# EAGLE design Tapper (EAGLE 9.4.2)

## Sheet 1 of 3
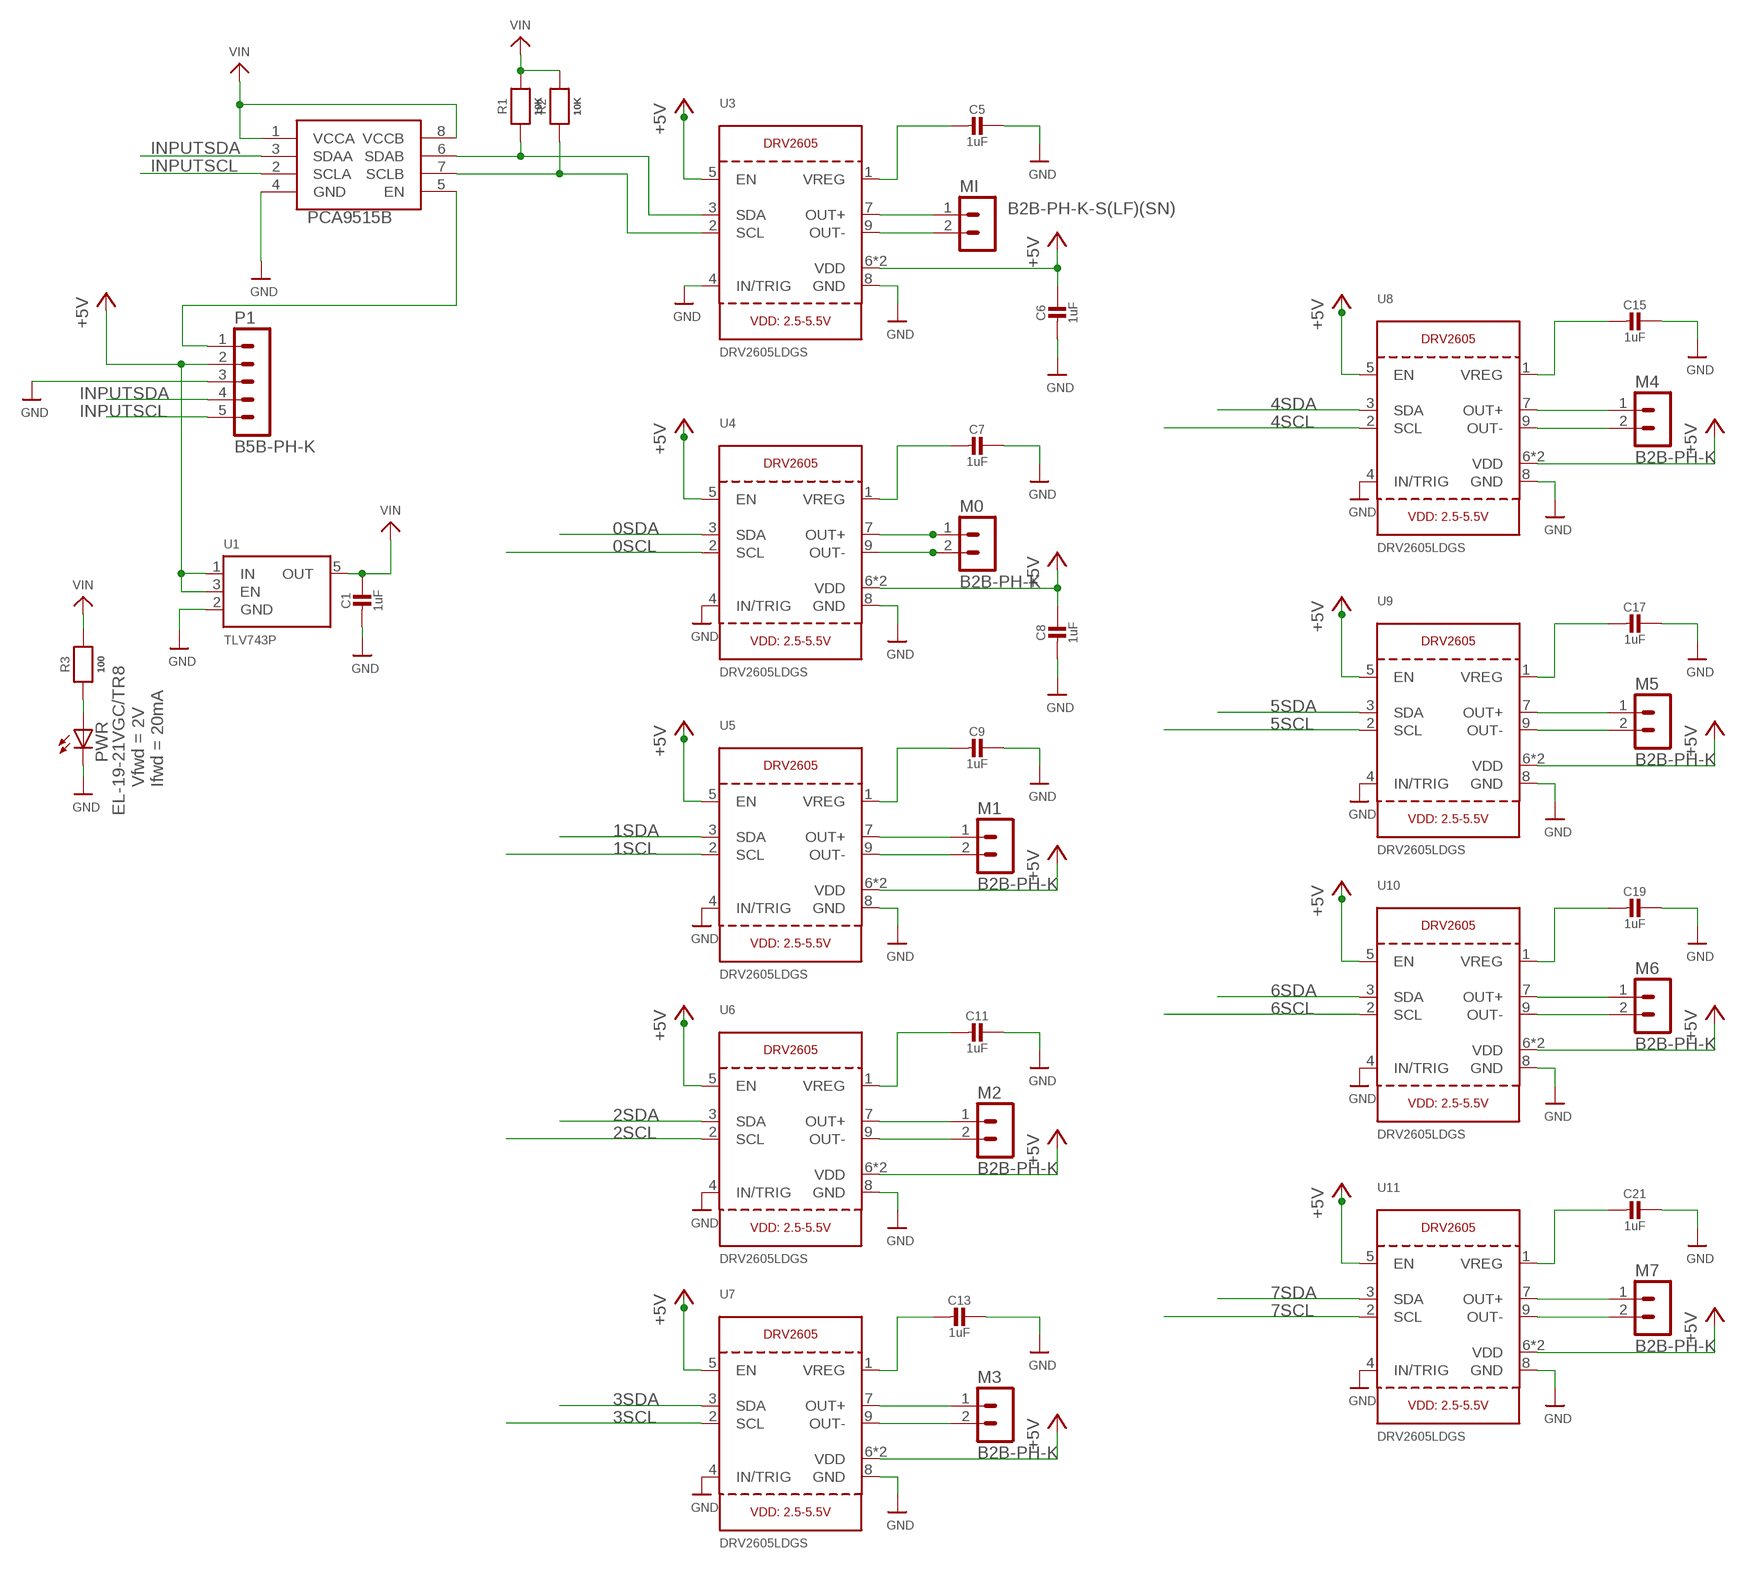
[diagram p0: schematic, sheet 1]

### Parts
C1  1uF  CAP_CERAMIC0805-NOOUTLINE  [0805-NO]
C5  1uF  CAP_CERAMIC0805-NOOUTLINE  [0805-NO]
C6  1uF  CAP_CERAMIC0805-NOOUTLINE  [0805-NO]
C7  1uF  CAP_CERAMIC0805-NOOUTLINE  [0805-NO]
C8  1uF  CAP_CERAMIC0805-NOOUTLINE  [0805-NO]
C9  1uF  CAP_CERAMIC0805-NOOUTLINE  [0805-NO]
C11  1uF  CAP_CERAMIC0805-NOOUTLINE  [0805-NO]
C13  1uF  CAP_CERAMIC0805-NOOUTLINE  [0805-NO]
C15  1uF  CAP_CERAMIC0805-NOOUTLINE  [0805-NO]
C17  1uF  CAP_CERAMIC0805-NOOUTLINE  [0805-NO]
C19  1uF  CAP_CERAMIC0805-NOOUTLINE  [0805-NO]
C21  1uF  CAP_CERAMIC0805-NOOUTLINE  [0805-NO]
M0  B2B-PH-K  [B2B-PH-K]
M1  B2B-PH-K  [B2B-PH-K]
M2  B2B-PH-K  [B2B-PH-K]
M3  B2B-PH-K  [B2B-PH-K]
M4  B2B-PH-K  [B2B-PH-K]
M5  B2B-PH-K  [B2B-PH-K]
M6  B2B-PH-K  [B2B-PH-K]
M7  B2B-PH-K  [B2B-PH-K]
MI  B2B-PH-K-S(LF)(SN)  B2B-PH-K  [B2B-PH-K]
P1  B5B-PH-K  [B5B-PH-K]
PWR  EL-19-21VGC/TR8  LEDCHIP-LED0603  [CHIP-LED0603]
R1  10K  RESISTOR0805_NOOUTLINE  [0805-NO]
R2  10K  RESISTOR0805_NOOUTLINE  [0805-NO]
R3  100  RESISTOR0805_NOOUTLINE  [0805-NO]
U1  TLV743P  LD39015XX  [SOT23-5]
U3  DRV2605LDGS  DRV2605_SOP  [PSOP10]
U4  DRV2605LDGS  DRV2605_SOP  [PSOP10]
U5  DRV2605LDGS  DRV2605_SOP  [PSOP10]
U6  DRV2605LDGS  DRV2605_SOP  [PSOP10]
U7  DRV2605LDGS  DRV2605_SOP  [PSOP10]
U8  DRV2605LDGS  DRV2605_SOP  [PSOP10]
U9  DRV2605LDGS  DRV2605_SOP  [PSOP10]
U10  DRV2605LDGS  DRV2605_SOP  [PSOP10]
U11  DRV2605LDGS  DRV2605_SOP  [PSOP10]
U23  PCA9515B  PCA9517  [SO-08]

### Nets
0SCL: U4.2(SCL) ; also sheet 2
0SDA: U4.3(SDA) ; also sheet 2
1SCL: U5.2(SCL) ; also sheet 2
1SDA: U5.3(SDA) ; also sheet 2
2SCL: U6.2(SCL) ; also sheet 2
2SDA: U6.3(SDA) ; also sheet 2
3SCL: U7.2(SCL) ; also sheet 2
3SDA: U7.3(SDA) ; also sheet 2
4SCL: U8.2(SCL) ; also sheet 2
4SDA: U8.3(SDA) ; also sheet 2
5SCL: U9.2(SCL) ; also sheet 2
5SDA: U9.3(SDA) ; also sheet 2
6SCL: U10.2(SCL) ; also sheet 2
6SDA: U10.3(SDA) ; also sheet 2
7SCL: U11.2(SCL) ; also sheet 2
7SDA: U11.3(SDA) ; also sheet 2
+5V [Power]: C6.1 C8.1 P1.2 U1.1(IN) U1.3(EN) U3.5(EN) U3.6(VDD) U3.10(VDD) U4.5(EN) U4.6(VDD) U4.10(VDD) U5.5(EN) U5.6(VDD) U5.10(VDD) U6.5(EN) U6.6(VDD) U6.10(VDD) U7.5(EN) U7.6(VDD) U7.10(VDD) U8.5(EN) U8.6(VDD) U8.10(VDD) U9.5(EN) U9.6(VDD) U9.10(VDD) U10.5(EN) U10.6(VDD) U10.10(VDD) U11.5(EN) U11.6(VDD) U11.10(VDD)
GND [Ground]: C1.2 C5.1 C6.2 C7.1 C8.2 C9.1 C11.1 C13.1 C15.1 C17.1 C19.1 C21.1 P1.3 PWR.C U1.2(GND) U3.4(IN/TRIG) U3.8(GND) U4.4(IN/TRIG) U4.8(GND) U5.4(IN/TRIG) U5.8(GND) U6.4(IN/TRIG) U6.8(GND) U7.4(IN/TRIG) U7.8(GND) U8.4(IN/TRIG) U8.8(GND) U9.4(IN/TRIG) U9.8(GND) U10.4(IN/TRIG) U10.8(GND) U11.4(IN/TRIG) U11.8(GND) U23.4(GND) ; also sheet 2
INPUTSCL: P1.5 U23.2(SCLA) ; also sheet 2
INPUTSDA: P1.4 U23.3(SDAA) ; also sheet 2
N$1: M0.2 U4.9(OUT-)
N$2: C5.2 U3.1(VREG)
N$3: C7.2 U4.1(VREG)
N$4: C9.2 U5.1(VREG)
N$5: P1.1 U23.5(EN)
N$6: C11.2 U6.1(VREG)
N$7: C13.2 U7.1(VREG)
N$8: C15.2 U8.1(VREG)
N$9: C17.2 U9.1(VREG)
N$10: C19.2 U10.1(VREG)
N$11: C21.2 U11.1(VREG)
N$12: R1.1 U3.3(SDA) U23.6(SDAB)
N$13: R2.1 U3.2(SCL) U23.7(SCLB)
N$14: PWR.A R3.1
OUT+2: MI.1 U3.7(OUT+)
OUT+3: M0.1 U4.7(OUT+)
OUT+4: M1.1 U5.7(OUT+)
OUT+5: M2.1 U6.7(OUT+)
OUT+6: M3.1 U7.7(OUT+)
OUT+7: M4.1 U8.7(OUT+)
OUT+8: M5.1 U9.7(OUT+)
OUT+9: M6.1 U10.7(OUT+)
OUT+10: M7.1 U11.7(OUT+)
OUT-2: MI.2 U3.9(OUT-)
OUT-4: M1.2 U5.9(OUT-)
OUT-5: M2.2 U6.9(OUT-)
OUT-6: M3.2 U7.9(OUT-)
OUT-7: M4.2 U8.9(OUT-)
OUT-8: M5.2 U9.9(OUT-)
OUT-9: M6.2 U10.9(OUT-)
OUT-10: M7.2 U11.9(OUT-)
VIN: C1.1 R1.2 R2.2 R3.2 U1.5(OUT) U23.1(VCCA) U23.8(VCCB) ; also sheet 2

### Notes on the sheet
- PCA9515B
- Vfwd = 2V
  Ifwd = 20mA

## Sheet 2 of 3
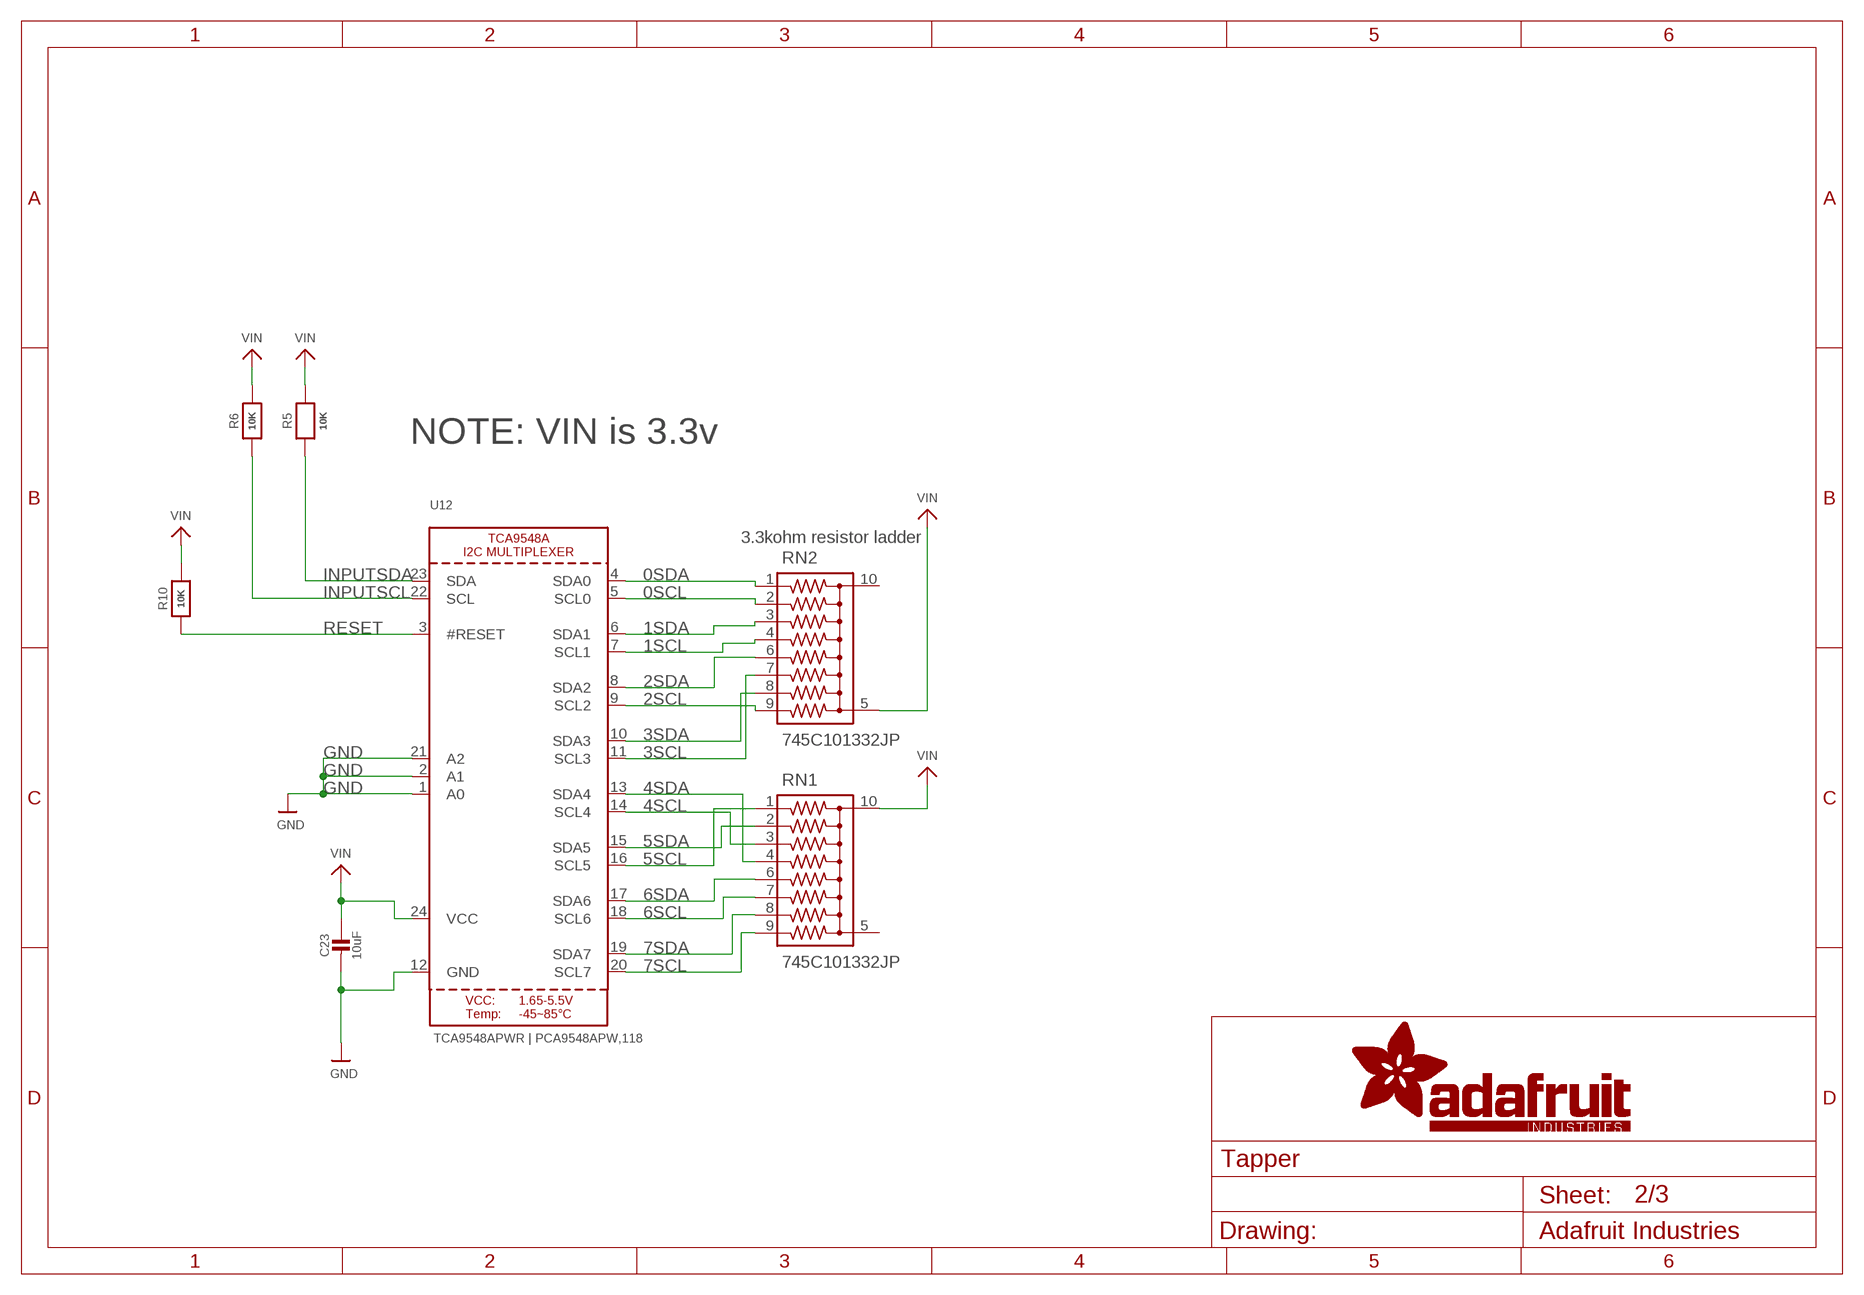
[diagram p1: schematic, sheet 2]

### Parts
C23  10uF  CAP_CERAMIC0805-NOOUTLINE  [0805-NO]
R5  10K  RESISTOR0805_NOOUTLINE  [0805-NO]
R6  10K  RESISTOR0805_NOOUTLINE  [0805-NO]
R10  10K  RESISTOR_0805MP  [_0805MP]
RN1  745C101332JP  745-10NS  [745-10NS]
RN2  745C101332JP  745-10NS  [745-10NS]
U12  TCA9548APWR | PCA9548APW,118  TCA9548A  [TSSOP24]

### Nets
0SCL: RN2.2 U12.5(SCL0) ; also sheet 1
0SDA: RN2.1 U12.4(SDA0) ; also sheet 1
1SCL: RN2.4 U12.7(SCL1) ; also sheet 1
1SDA: RN2.3 U12.6(SDA1) ; also sheet 1
2SCL: RN2.9 U12.9(SCL2) ; also sheet 1
2SDA: RN2.6 U12.8(SDA2) ; also sheet 1
3SCL: RN2.7 U12.11(SCL3) ; also sheet 1
3SDA: RN2.8 U12.10(SDA3) ; also sheet 1
4SCL: RN1.3 U12.14(SCL4) ; also sheet 1
4SDA: RN1.4 U12.13(SDA4) ; also sheet 1
5SCL: RN1.1 U12.16(SCL5) ; also sheet 1
5SDA: RN1.2 U12.15(SDA5) ; also sheet 1
6SCL: RN1.7 U12.18(SCL6) ; also sheet 1
6SDA: RN1.6 U12.17(SDA6) ; also sheet 1
7SCL: RN1.9 U12.20(SCL7) ; also sheet 1
7SDA: RN1.8 U12.19(SDA7) ; also sheet 1
GND [Ground]: C23.2 U12.1(A0) U12.2(A1) U12.12(GND) U12.21(A2) ; also sheet 1
INPUTSCL: R6.1 U12.22(SCL) ; also sheet 1
INPUTSDA: R5.1 U12.23(SDA) ; also sheet 1
RESET: R10.1 U12.3(#RESET)
VIN: C23.1 R5.2 R6.2 R10.2 RN1.10 RN2.5 U12.24(VCC) ; also sheet 1
Unconnected: RN1.5 RN2.10

### Notes on the sheet
- NOTE: VIN is 3.3v
- 3.3kohm resistor ladder

## Sheet 3 of 3

## Library data of the parts
C1 C5-C9 C11 C13 C15 C17 C19 C21 C23 = microbuilder:CAP_CERAMIC: Ceramic Capacitors For new designs, use the packages preceded by an '_' character since they are more reliable: The following footprints should be used on most boards: _0402 - Standard footprint for regular board layouts _0603 - Standard footprint for regular board layouts _0805 - Standard footprint for regular board layouts _1206 - Standard footprint for regular board layouts For extremely tight-pitch boards where space is at a premium, the following 'micro-pitch' footprints can be used (smaller pads, no silkscreen outline, etc.): _0402MP - Micro-pitch footprint for very dense/compact boards _0603MP - Micro-pitch footprint for very dense/compact boards _0805MP - Micro-pitch footprint for very dense/compact boards _1206MP - Micro-pitch footprint for very dense/compact boards
M0 M1-M7 MI = con-jst-ph:B2B-PH-K: HEADER
P1 = con-jst-ph:B5B-PH-K: HEADER
PWR = adafruit:LED: LED OSRAM: - CHIPLED LG R971, LG N971, LY N971, LG Q971, LY Q971, LO R971, LY R971 LH N974, LH R974 LS Q976, LO Q976, LY Q976 LO Q996 - Hyper CHIPLED LW Q18S LB Q993, LB Q99A, LB R99A - SideLED LS A670, LO A670, LY A670, LG A670, LP A670 LB A673, LV A673, LT A673, LW A673 LH A674 LY A675 LS A676, LA A676, LO A676, LY A676, LW A676 LS A679, LY A679, LG A679 - Hyper Micro SIDELED® LS Y876, LA Y876, LO Y876, LY Y876 LT Y87S - SmartLED LW L88C, LW L88S LB L89C, LB L89S, LG L890 LS L89K, LO L89K, LY L89K LS L896, LA L896, LO L896, LY L896 - TOPLED LS T670, LO T670, LY T670, LG T670, LP T670 LSG T670, LSP T670, LSY T670, LOP T670, LYG T670 LG T671, LOG T671, LSG T671 LB T673, LV T673, LT T673, LW T673 LH T674 LS T676, LA T676, LO T676, LY T676, LB T676, LH T676, LSB T676, LW T676 LB T67C, LV T67C, LT T67C, LS T67K, LO T67K, LY T67K, LW E67C LS E67B, LA E67B, LO E67B, LY E67B, LB E67C, LV E67C, LT E67C LW T67C LS T679, LY T679, LG T679 LS T770, LO T770, LY T770, LG T770, LP T770 LB T773, LV T773, LT T773, LW T773 LH T774 LS E675, LA E675, LY E675, LS T675 LS T776, LA T776, LO T776, LY T776, LB T776 LHGB T686 LT T68C, LB T68C - Hyper Mini TOPLED® LB M676 - Mini TOPLED Santana® LG M470 LS M47K, LO M47K, LY M47K Source: http://www.osram.convergy.de/
R1-R3 R5 R6 R10 = microbuilder:RESISTOR: Resistors For new designs, use the packages preceded by an '_' character since they are more reliable: The following footprints should be used on most boards: _0402 - Standard footprint for regular board layouts _0603 - Standard footprint for regular board layouts _0805 - Standard footprint for regular board layouts _1206 - Standard footprint for regular board layouts For extremely tight-pitch boards where space is at a premium, the following 'micro-pitch' footprints can be used (smaller pads, no silkscreen outline, etc.): _0402MP - Micro-pitch footprint for very dense/compact boards _0603MP - Micro-pitch footprint for very dense/compact boards _0805MP - Micro-pitch footprint for very dense/compact boards _1206MP - Micro-pitch footprint for very dense/compact boards
RN1 RN2 = resistor-array:745-10: CTS 745 Series 8 Resistors, 10 Terminations
U1 = microbuilder:LD39015XX: LDO Fixed Voltage Regulator 150mA The LD39015xx voltage regulator is ideal for regulating battery or solar power due to it's very low foreward voltage drop (~100mV at 150mA). Forward Voltage Dropout: 100mV at 150mA, 80mV at 100mA Input Voltage Range: 1.5V-5.5V Output Voltage Range: 0.8V-3.3V (depending on model) Digikey: 1.8V - 497-6977-1-ND
U3-U11 = microbuilder:DRV2605: DRV2605 - Haptic Driver for ERM/LRA Motors
U12 = microbuilder:TCA9548A: TCA9548A I2C Multiplexer
U23 = PCA9517:PCA9517

## Net classes
1 Ground: width 0.203 mm, drill 0.305 mm
2 Power: width 0.305 mm, drill 0.305 mm

## Board
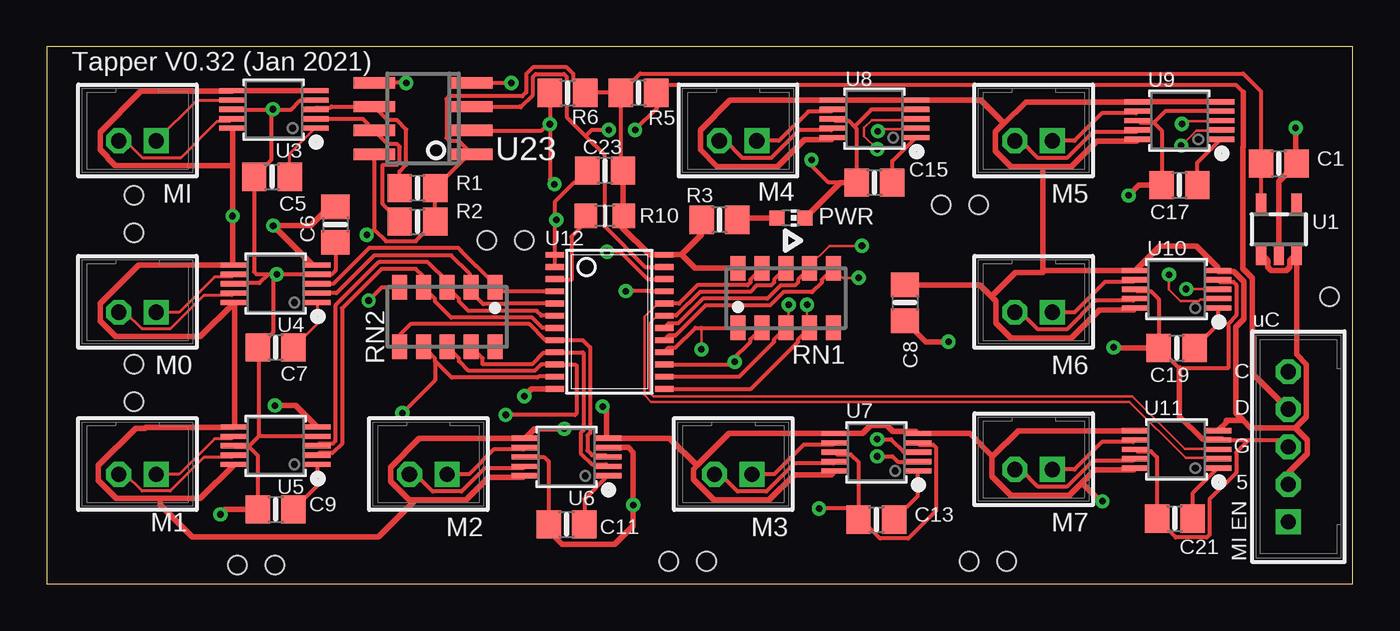
[diagram p2: board, top side]
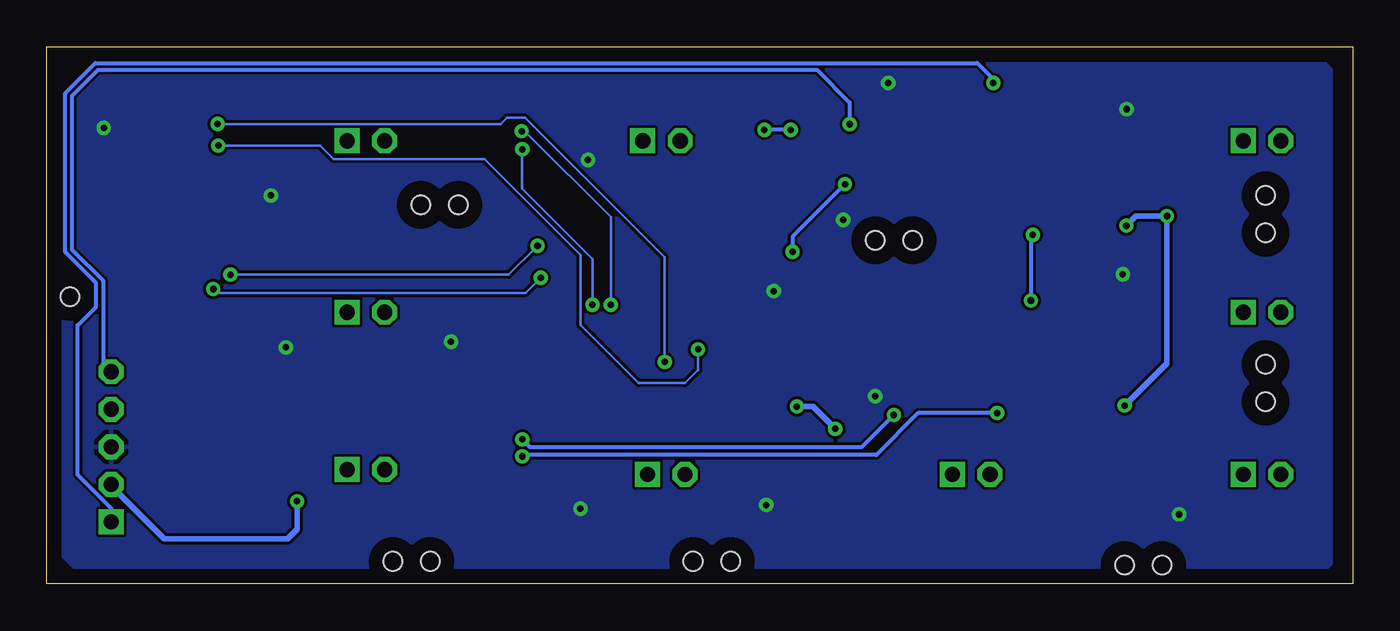
[diagram p3: board, bottom side, seen from below]

Size 69.58 x 28.63 mm. Coordinates in mm from the lower left corner, seen from the top.
Outline: 0,0 69.58,0 69.58,28.63 0,28.63 0,0
Copper layers (1+16): Top 0.035mm / dielectric 1.5mm / Bottom 0.035mm
Design rules "default *": minimum track width 5mil, minimum drill 0.35mm, track to track 6mil, track to pad 6mil, pad to pad 6mil, via to via 6mil, smd to smd 6mil, copper to edge 30mil, drill to drill 6mil, minimum pad ring 10mil, minimum via ring 8mil, stop-mask expansion 4mil, vias tented up to drill 0mil, thermal gap 10mil
Holes 1 mm at 4.64,20.71 4.64,18.71 4.64,11.71 4.64,9.71 23.44,18.31 25.44,18.31 47.64,20.21 49.64,20.21 49.14,1.21 51.14,1.21 33.14,1.21 35.14,1.21 10.14,1.01 12.14,1.01 68.34,15.31

### Footprints (pad centres in the part's own frame; a part is rotated, then mirrored left to right if it is on the bottom)
0805-NO = smd 1.3 x 1.5: 1 -0.95,0; 2 0.95,0
B2B-PH-K = drill 0.813 square: 1 -1,0 | drill 0.813 octagon: 2 1,0
B5B-PH-K = drill 0.813 square: 1 -4,0 | drill 0.813 octagon: 2 -2,0; 3 0,0; 4 2,0; 5 4,0
CHIP-LED0603 = smd 0.8 x 0.8: A 0,-0.75; C 0,0.75
_0805MP = smd 1.2 x 1.3: 1 -1.016,0; 2 1.016,0
745-10NS = smd 0.8 x 1.3: 1 -2.54,-1.587; 2 -1.27,-1.587; 3 0,-1.587; 4 1.27,-1.587; 5 2.54,-1.587; 6 2.54,1.587; 7 1.27,1.587; 8 0,1.587; 9 -1.27,1.587; 10 -2.54,1.587
SOT23-5 = smd 0.55 x 1.2: 1 -0.95,-1.3; 2 0,-1.3; 3 0.95,-1.3; 4 0.95,1.3; 5 -0.95,1.3
PSOP10 = smd 0.28 x 1.45: 1 -1,-2.2; 2 -0.5,-2.2; 3 0,-2.2; 4 0.5,-2.2; 5 1,-2.2; 6 1,2.2; 7 0.5,2.2; 8 0,2.2; 9 -0.5,2.2; 10 -1,2.2
TSSOP24 = smd 0.305 x 0.991: 1 -3.575,-2.918; 2 -2.925,-2.918; 3 -2.275,-2.918; 4 -1.625,-2.918; 5 -0.975,-2.918; 6 -0.325,-2.918; 7 0.325,-2.918; 8 0.975,-2.918; 9 1.625,-2.918; 10 2.275,-2.918; 11 2.925,-2.918; 12 3.575,-2.918; 13 3.575,2.918; 14 2.925,2.918; 15 2.275,2.918; 16 1.625,2.918; 17 0.975,2.918; 18 0.325,2.918; 19 -0.325,2.918; 20 -0.975,2.918; 21 -1.625,2.918; 22 -2.275,2.918; 23 -2.925,2.918; 24 -3.575,2.918
SO-08 = smd 0.6 x 2.2: 1 -1.905,-2.6; 2 -0.635,-2.6; 3 0.635,-2.6; 4 1.905,-2.6; 5 1.905,2.6; 6 0.635,2.6; 7 -0.635,2.6; 8 -1.905,2.6

### Placement (x,y rotation side)
C1  65.64,22.41 0 top
C5  11.99,21.7 0 top
C6  15.37,19.16 270 top
C7  12.19,12.61 0 top
C8  45.72,14.99 270 top
C9  12.19,3.97 0 top
C11  27.69,3.17 0 top
C13  44.2,3.43 0 top
C15  44.1,21.4 0 top
C17  60.35,21.25 0 top
C19  60.2,12.57 0 top
C21  60.1,3.48 0 top
C23  29.75,22.03 180 top
M0  4.83,14.48 180 top
M1  4.83,5.84 180 top
M2  20.32,5.84 180 top
M3  36.58,5.84 180 top
M4  36.83,23.62 180 top
M5  52.58,23.62 180 top
M6  52.58,14.48 180 top
M7  52.58,6.1 180 top
MI  4.83,23.62 180 top
P1  66.14,7.31 90 top
PWR  39.64,19.51 270 top
R1  19.74,21.11 0 top
R2  19.74,19.31 0 top
R3  35.84,19.41 180 top
R5  31.53,26.18 180 top
R6  27.75,26.18 0 top
R10  29.73,19.63 0 top
RN1  39.37,15.24 0 top
RN2  21.34,14.22 180 top
U1  65.64,18.91 0 top
U3  12.09,25.29 90 top
U4  12.19,16 90 top
U5  12.19,7.36 90 top
U6  27.69,6.76 90 top
U7  44.2,7.02 90 top
U8  44.1,24.79 90 top
U9  60.35,24.7 90 top
U10  60.2,15.71 90 top
U11  60.2,7.17 90 top
U12  29.97,13.97 270 top
U23  20.04,24.81 90 top

### Tracks (layer width: path | path; a pad name or v marks a point on that pad's centre or on a via)
0SCL
  Top 0.203: U12.5 24.42,14.95 24.38,14.91 23.24,14.91 22.61,15.54 RN2.2 22.54,15.87 22.54,16.51 21.54,17.51 17.44,17.51 15.44,15.5 U4.2
0SDA
  Top 0.203: U12.4 24.09,15.59 RN2.1 23.88,15.95 22.88,16.94 22.08,17.74 22.08,17.75 21.91,17.91 17.19,17.91 15.28,16 U4.3
1SCL
  Top 0.203: U12.7 26.41,13.64 25.85,14.2 21.54,14.2 20.68,15.06 20.68,15.2 RN2.4 20.07,16.38 19.66,16.79 17.84,16.79 15.73,14.69 15.73,7.47 15.23,6.97 14.5,6.97 U5.2
1SDA
  Top 0.203: U12.6 26.35,14.29 26.1,14.55 22.46,14.55 21.95,15.06 21.95,15.2 RN2.3 21.34,16.1 21.34,16.11 20.3,17.15 17.69,17.15 15.37,14.83 15.37,7.62 15.22,7.47 14.5,7.47 U5.3
2SCL
  Top 0.203: RN2.9 23.22,12.02 23.22,11.71 25.84,11.71 26.44,12.31 27.02,12.31 U12.9 28.55,12.34 28.59,12.31 28.59,8.19 28.45,8.05 28.45,6.96 29.04,6.37 29.78,6.37 U6.2
2SDA
  Top 0.203: RN2.6 18.8,13.26 19.38,13.84 25.71,13.84 26.55,12.99 U12.8 28.55,12.99 28.94,12.61 28.94,8.05 28.8,7.9 28.8,7.11 29.04,6.87 29.78,6.87 U6.3
3SCL  (via drill 0.35)
  Top 0.203: U12.11 26.19,11.04 26.14,10.99 21.57,10.99 20.68,11.88 | 20.68,11.88 20.68,12.02 RN2.7 | v18.94,9.11 20.68,10.84 20.68,11.88 | v44.24,6.8 45.05,6.8 45.34,6.51 U7.2
  Bottom 0.203: v18.94,9.11 23.15,9.11 25.38,6.87 44.18,6.87 44.24,6.81 v44.24,6.8
3SDA  (via drill 0.35)
  Top 0.203: RN2.8 21.95,12.02 21.95,11.88 22.48,11.35 25.99,11.35 26.34,11.7 U12.10 28.16,11.7 28.23,11.62 28.23,9.11 28.13,9.01 v24.44,9.01 | U7.3 46.36,7.06 45.63,7.06 44.98,7.71 v44.24,7.71
  Bottom 0.203: v44.24,7.71 43.84,7.31 26.14,7.31 v24.44,9.01
4SCL  (via drill 0.35)
  Top 0.127: v44.28,24.13 44.39,24.24 46.23,24.24 U8.2 | v39.53,14.88 39.53,13.76 39.46,13.69 RN1.3
  Top 0.203: RN1.3 38.75,13.04 38.75,12.9 36.9,11.04 U12.14
  Bottom 0.127: v44.28,24.13 44.16,24.01 43.98,24.01 39.53,19.56 v39.53,14.88
4SDA  (via drill 0.35)
  Top 0.127: v44.25,23.17 43.55,23.87 43.55,24.31 43.97,24.73 46.23,24.73 U8.3 | v40.51,14.88 40.51,13.62 RN1.4
  Top 0.203: RN1.4 40.02,13.04 40.02,12.9 37.52,10.39 U12.13
  Bottom 0.127: v44.25,23.17 44.25,21.07 40.51,17.32 v40.51,14.88
5SCL  (via drill 0.35)
  Top 0.127: v60.44,23.37 61.24,24.17 62.51,24.17 U9.2 | 34.88,13.65 v34.88,12.5
  Top 0.203: U12.16 33.13,12.59 33.49,12.59 34.55,13.65 34.88,13.65 RN1.1
  Bottom 0.127: v60.44,23.37 55,23.37 54.29,22.65 46.25,22.65 41.13,17.53 41.13,13.8 38.04,10.71 35.57,10.71 34.88,11.4 v34.88,12.5
5SDA  (via drill 0.35)
  Top 0.127: v60.48,24.52 60.62,24.66 62.51,24.66 U9.3 | v36.65,11.83 36.54,11.95
  Top 0.203: RN1.2 37.48,13.04 37.48,12.9 36.54,11.95 36.28,11.7 U12.15
  Bottom 0.127: v60.48,24.52 45.4,24.52 45.06,24.86 44.1,24.86 36.65,17.41 v36.65,11.83
6SCL  (via drill 0.35)
  Top 0.127: v59.8,16.48 59.8,15.68 60.39,15.09 61.39,15.09 61.46,15.16 62.37,15.16 U10.2 | v43.43,18.02 41.69,18.02 40.58,16.9 RN1.7
  Top 0.203: RN1.7 40.02,16.21 40.02,16.07 39.86,15.91 39.09,15.91 38.39,15.21 34.95,15.21 33.63,13.89 33.13,13.89 U12.18
  Bottom 0.127: v59.8,16.48 44.97,16.48 v43.43,18.02
6SDA  (via drill 0.35)
  Top 0.127: v60.71,15.72 62.37,15.72 U10.3 | v43.26,16.32 42.42,16.32 RN1.6
  Top 0.203: RN1.6 41.29,16.21 41.29,16.07 40.77,15.55 39.24,15.55 38.54,14.85 35.1,14.85 33.49,13.24 33.13,13.24 U12.17
  Bottom 0.127: v43.26,16.32 44.06,15.52 60.51,15.52 v60.71,15.72
7SCL
  Top 0.127: U11.2 62.37,6.71 60.69,6.71 57.69,9.71 32.19,9.71 31.84,10.06 31.84,14.25 32.47,14.88 32.82,14.88 U12.20
  Top 0.203: RN1.9 37.48,16.21 37.48,16.07 37.34,15.92 34.66,15.92 33.68,14.95 U12.20
7SDA
  Top 0.127: U11.3 62.37,7.2 60.62,7.2 57.83,9.99 32.33,9.99 32.12,10.2 32.12,13.9 32.47,14.25 32.82,14.25 U12.19
  Top 0.203: RN1.8 38.75,16.21 38.75,16.07 38.59,15.91 37.82,15.91 37.48,15.57 34.81,15.57 33.54,14.29 U12.19
+5V  (via drill 0.35)
  Top 0.305: U3.10 9.89,22.31 | 9.89,22.31 v9.89,19.61 9.89,17.1 U4.6 4.89,17 2.84,14.95 2.84,14.01 3.66,13.18 8.18,13.18 U4.10 U5.6 9.96,8.33 5.27,8.33 5.23,8.29 4.72,8.29 2.74,6.31 2.74,5.51 3.7,4.55 6.04,4.55 | 9.89,22.31 3.64,22.31 3.24,22.71 3.24,22.75 2.84,23.15 2.84,24.09 5,26.26 9.86,26.26 U3.6 U3.5 | 6.04,4.55 8.18,4.55 U5.10 | U6.10 25.39,5.66 23.52,5.66 22.33,4.47 19.64,4.47 | 19.64,4.47 19.3,4.47 18.31,5.46 18.31,6.22 19.84,7.76 U6.6 25.56,7.82 26,8.26 v27.56,8.26 | 34.65,6.31 36.35,8.01 U7.6 43.46,8.02 43.88,8.44 44.75,8.44 45.07,8.12 46.3,8.12 U7.5 49.18,8.02 50.39,6.81 | 34.65,6.31 34.44,6.11 34.44,5.58 35.55,4.47 38.49,4.47 39.84,5.82 41.8,5.82 U7.10 | U11.6 51.75,8.17 50.39,6.81 | 50.39,6.81 50.34,6.81 50.34,5.74 51.35,4.73 54.49,4.73 55.16,5.39 | U11.10 57.9,6.07 55.84,6.07 55.16,5.39 | 53.08,16.7 U10.6 59.3,18.01 61.24,18.01 62.4,16.85 U10.5 62.45,16.65 63.25,16.65 63.78,16.12 63.78,14.13 63.35,13.7 63.35,9.1 63.74,8.71 | U10.10 57.9,14.61 56.09,14.61 54.59,13.11 51.35,13.11 50.56,13.9 50.56,15.09 50.33,15.32 | 50.33,15.32 51.61,16.6 53.08,16.6 53.08,16.7 | 50.99,24.56 50.54,24.11 50.54,23.06 51.35,22.25 53.08,22.25 | U9.10 58.05,23.6 55.94,23.6 54.59,22.25 53.08,22.25 | U8.10 41.8,23.69 40.38,23.69 38.94,22.25 35.71,22.25 34.82,23.14 34.82,24.2 36.4,25.78 U8.6 U8.5 49.76,25.79 50.99,24.56 | 50.99,24.56 51.01,24.54 52.16,25.69 U9.6 U9.5 | C6.1 15.07,20.11 14.06,19.09 v12.06,19.09 14.15,17 U4.5 | 34.65,6.31 33.19,7.76 U6.5 29.82,7.82 29.82,9.24 v29.61,9.45 | 19.64,4.47 17.68,2.51 7.74,2.51 6.04,4.21 6.04,4.55 | v12.14,9.51 13.25,9.51 U5.5
  Top 0.305: U11.5 62.84,8.62 62.84,8.71 63.74,8.71 | C8.1 49.71,15.94 50.33,15.32 | v56.24,4.41 56.14,4.41 55.16,5.39 | 53.08,16.7 53.08,22.25 | 66.52,8.32 67.16,7.68 67.16,6.93 66.14,5.91 P1.2 | 63.74,8.71 64.13,8.32 66.52,8.32 | U1.1 65.06,17.24 65.06,16.88 65.24,16.7 66.05,16.7 66.22,16.88 66.22,17.24 U1.3 66.59,12.22 67.11,11.71 67.11,8.91 66.54,8.34 66.52,8.32
  Bottom 0.305: v12.06,19.09 11.54,19.61 v9.89,19.61 9.89,11.76 v12.14,9.51 | v56.24,4.41 56.24,2.91 56.74,2.41 63.32,2.41 66.14,5.23 P1.2 | v29.61,9.45 28.75,9.45 v27.56,8.26
GND  (via drill 0.35)
  Top 0.203: U5.8 10.06,7.29 10.71,7.29 | 11.28,7.86 10.71,7.29 | U4.8 10.02,16.03 11.31,16.03 11.78,16.5 | 12.04,16.5 U4.4 15.16,16.5 15.37,16.71 C6.2 | 12.04,16.5 11.78,16.5 | 11.78,16.5 11.18,16.5 11.04,16.64 C5.1 11.94,22.6 11.94,25.29 | U3.4 14.26,25.76 13.47,25.76 13,25.29 11.94,25.29 | U3.8 11.94,25.29 | 12.04,16.5 12.04,13.41 C7.1 11.28,12.57 11.28,7.86 | 10.71,7.29 10.75,7.26 10.82,7.26 11.24,6.84 C9.1 | C11.1 26.74,6.54 26.72,6.53 26.49,6.76 U6.8 | U7.8 42.1,6.91 42.83,6.91 43.25,6.49 C13.1 | U7.4 46.5,7.41 47.23,7.41 47.38,7.26 47.38,3.9 45.9,2.42 44.39,2.42 43.39,3.43 C13.1 | U11.8 58.1,7.07 58.83,7.07 59.15,6.75 C21.1 60.15,2.48 61.8,2.48 61.95,2.63 61.95,4.5 63.38,5.93 63.38,7 64.04,7.67 | U11.4 62.64,7.67 64.04,7.67 | U10.8 58.1,15.6 58.83,15.6 59.25,15.18 C19.1 60.31,11.51 60.34,11.51 62.94,11.51 62.94,13.86 63.38,14.3 63.38,15.95 63.23,16.1 62.5,16.1 U10.4 | U9.8 58.26,24.59 58.98,24.59 | 58.98,24.59 59.4,24.17 C17.1 | U8.8 42,24.68 42.73,24.68 43.02,24.39 | 43.02,24.39 43.15,24.26 C15.1 41.65,21.4 40.74,22.31 v40.74,22.61 | U8.4 43.93,25.29 43.02,24.39 | C23.2 28.16,21.39 28.1,21.39 27.05,20.34 27.05,19.41 | 27.05,19.41 U12.1 U12.2 | 26.88,3.17 C11.1 | C13.1 42.66,4.01 v41.14,4.01 | U12.21 32.15,15.59 32.14,15.61 v30.84,15.61 | C11.1 26.56,2.99 | U9.4 59.59,25.2 58.98,24.59 | U5.4 14.38,7.89 11.38,7.89 11.28,7.86 | 45.68,14.11 C8.2 | 64.04,7.67 65.78,7.67 P1.3 | v27.14,19.41 27.05,19.41 | U23.4 v24.74,26.71
  Top 0.305: U1.2 65.64,21.46 C1.2 66.54,22.46 v66.54,24.31 | 62.64,7.67 62.6,7.71 61.56,7.71 60.34,8.93 60.34,11.51 | C17.1 58.19,21.25 v57.64,20.71 | 41.04,4.01 v41.14,4.01 | U12.12 25.83,10.39 v25.44,10.01 | C9.1 9.51,3.97 v9.24,3.71 | C19.1 56.88,12.57 v56.84,12.61 | C8.2 46.85,12.91 v48.04,12.91 | U6.4 30.99,7.26 31.24,7.01 v31.24,4.21 31.24,3.11 30.24,2.11 27.44,2.11 26.56,2.99 | PWR.C 42.29,21.4 C15.1
  other vias: 12.24,16.51 12.04,25.31
  pour Bottom: 1.84,27.71 68.34,27.71 68.74,27.31 68.74,1.51 68.14,0.91 1.34,0.91 1.14,1.11 1.14,27.41 1.24,27.51 1.44,27.71 1.64,27.71
INPUTSCL  (via drill 0.35)
  Top 0.203: v27.04,21.31 26.8,21.55 v26.8,24.51 26.8,24.61 | v29.84,17.71 30.54,17.71 32.01,16.25 U12.22 | R6.1 26.8,24.61 | U23.2 26.36,24.17 26.8,24.61
  Bottom 0.203: v27.04,21.31 29.84,18.51 v29.84,17.71 | P1.5 66.58,11.74 66.58,16.17 68.24,17.83 68.24,26.01 66.84,27.41 28.54,27.41 26.8,25.66 v26.8,24.51
INPUTSDA  (via drill 0.35)
  Top 0.203: U12.23 31.87,16.89 29.7,19.06 29.7,22.88 28.71,23.87 | R5.1 32.53,26.22 | 32.53,26.22 32.91,26.61 63.34,26.61 63.74,26.21 | U23.3 25.21,25.44 25.24,25.41 25.89,26.06 25.89,27.03 26.04,27.18 27.55,27.18 27.7,27.03 27.7,24.88 28.71,23.87 | 28.71,23.87 29.04,24.21 v29.94,24.21 | v31.34,24.21 32.53,25.39 32.53,26.22
  Top 0.305: 63.74,26.21 63.74,23.29 63.74,23.28 63.74,16.81 64.24,16.31 64.24,11.21 P1.4
  Bottom 0.203: v29.94,24.21 v31.34,24.21
N$1
  Top 0.152: U4.9 9.86,15.37 8.36,15.37 6.58,13.59 5.07,13.59 4.18,14.48 M0.2
N$2
  Top 0.152: C5.2 12.94,22.94 U3.1
N$3
  Top 0.152: U4.1 14.39,13.86 C7.2
N$4
  Top 0.203: U5.1 14.39,5.22 C9.2
N$5  (via drill 0.35)
  Top 0.203: v19.14,26.71 U23.5
  Bottom 0.203: P1.1 66.14,4.01 67.94,5.81 67.94,13.78 66.98,14.74 66.98,16.07 68.6,17.69 68.6,26.15 66.99,27.76 20,27.76 19.14,26.91 v19.14,26.71
N$6
  Top 0.203: U6.1 28.64,4.51 C11.2
N$7
  Top 0.203: U7.1 46.4,4.68 C13.2
N$8
  Top 0.203: C15.2 45.05,22.54 U8.1
N$9
  Top 0.203: C17.2 61.3,22.45 U9.1
N$10
  Top 0.203: U10.1 62.4,13.82 C19.2
N$11
  Top 0.203: U11.1 61.05,4.82 C21.2
N$12
  Top 0.203: U3.3 14.4,25.4 15.12,25.4 15.17,25.44 U23.6 18.16,24.72 18.65,24.72 19.15,24.22 19.15,22.35 18.79,21.99 R1.1
N$13
  Top 0.203: U3.2 16.82,24.79 U23.7 18.16,23.45 18.65,23.45 18.8,23.31 18.8,22.5 18.65,22.35 17.89,22.35 17.89,20.25 18.79,19.35 R2.1
N$14
  Top 0.305: PWR.A 36.89,19.51 R3.1
OUT+2
  Top 0.152: MI.1 7.99,25.79 U3.7
OUT+3
  Top 0.152: U4.7 9.86,16.37 8.93,16.37 7.04,14.48 M0.1
OUT+4
  Top 0.152: U5.7 9.86,7.73 8.93,7.73 7.04,5.84 M1.1
OUT+5
  Top 0.203: U6.7 25.38,7.16 23.81,7.16 22.5,5.84 M2.1
OUT+6
  Top 0.203: U7.7 41.89,7.41 40.32,7.41 38.75,5.84 M3.1
OUT+7
  Top 0.203: U8.7 41.79,25.18 40.57,25.18 39.01,23.62 M4.1
OUT+8
  Top 0.203: U9.7 58.05,25.09 56.23,25.09 54.75,23.62 M5.1
OUT+9
  Top 0.203: U10.7 57.89,16.1 56.38,16.1 54.75,14.48 M6.1
OUT+10
  Top 0.203: U11.7 57.89,7.57 56.23,7.57 54.75,6.1 M7.1
OUT-2
  Top 0.152: U3.9 9.76,24.66 9.07,24.66 7.15,22.73 5.07,22.73 4.18,23.62 MI.2
OUT-4
  Top 0.152: U5.9 9.86,6.73 8.36,6.73 6.58,4.95 5.07,4.95 4.18,5.84 M1.2
OUT-5
  Top 0.203: U6.9 25.38,6.16 23.32,6.16 22.09,4.93 20.55,4.93 19.64,5.84 M2.2
OUT-6
  Top 0.203: U7.9 41.89,6.41 39.83,6.41 38.34,4.93 36.81,4.93 35.9,5.84 M3.2
OUT-7
  Top 0.203: U8.9 41.79,24.18 40.07,24.18 38.6,22.71 37.06,22.71 36.15,23.62 M4.2
OUT-8
  Top 0.203: U9.9 58.05,24.09 55.73,24.09 54.34,22.71 52.81,22.71 51.9,23.62 M5.2
OUT-9
  Top 0.203: U10.9 57.89,15.1 55.88,15.1 54.34,13.56 52.81,13.56 51.9,14.48 M6.2
OUT-10
  Top 0.203: U11.9 57.89,6.57 55.73,6.57 54.34,5.18 52.81,5.18 51.9,6.1 M7.2
RESET
  Top 0.203: R10.1 28.71,19.28 27.94,18.51 27.94,16.21 27.09,16.21 U12.3
VIN  (via drill 0.35)
  Top 0.203: 17.44,18.9 18.07,18.27 19.66,18.27 R2.2 R1.2 22.49,22.9 U23.1 21.93,23.62 21.44,23.62 21.29,23.77 21.29,25.85 21.44,26 25.33,26 25.54,26.2 25.54,27.18 25.9,27.54 27.7,27.54 28.06,27.18 28.06,26.82 R6.2 R5.2 | U23.8 17.44,18.9 | C23.1 30.58,22.15 R5.2 | 17.44,18.9 17.15,18.61 v17.04,18.61 | v17.14,15.11 17.85,15.81 RN2.5 | R5.2 31.61,27.21 63.75,27.21 64.69,26.26 C1.1 U1.5
  Top 0.305: RN1.10 34.52,16.83 33.8,17.54 | 33.8,17.54 U12.24 32.1,17.54 30.64,19.01 30.75,19.11 R10.2 30.7,19.68 C23.1 | R3.2 34.89,18.63 33.8,17.54
  Bottom 0.203: v17.04,18.61 17.14,18.51 v17.14,15.11

### Text on the board
tNames: Tapper V0.32 (Jan 2021) | uC | C | D | G | 5 | MI EN